# EAGLE design SW6 (EAGLE 5.06)
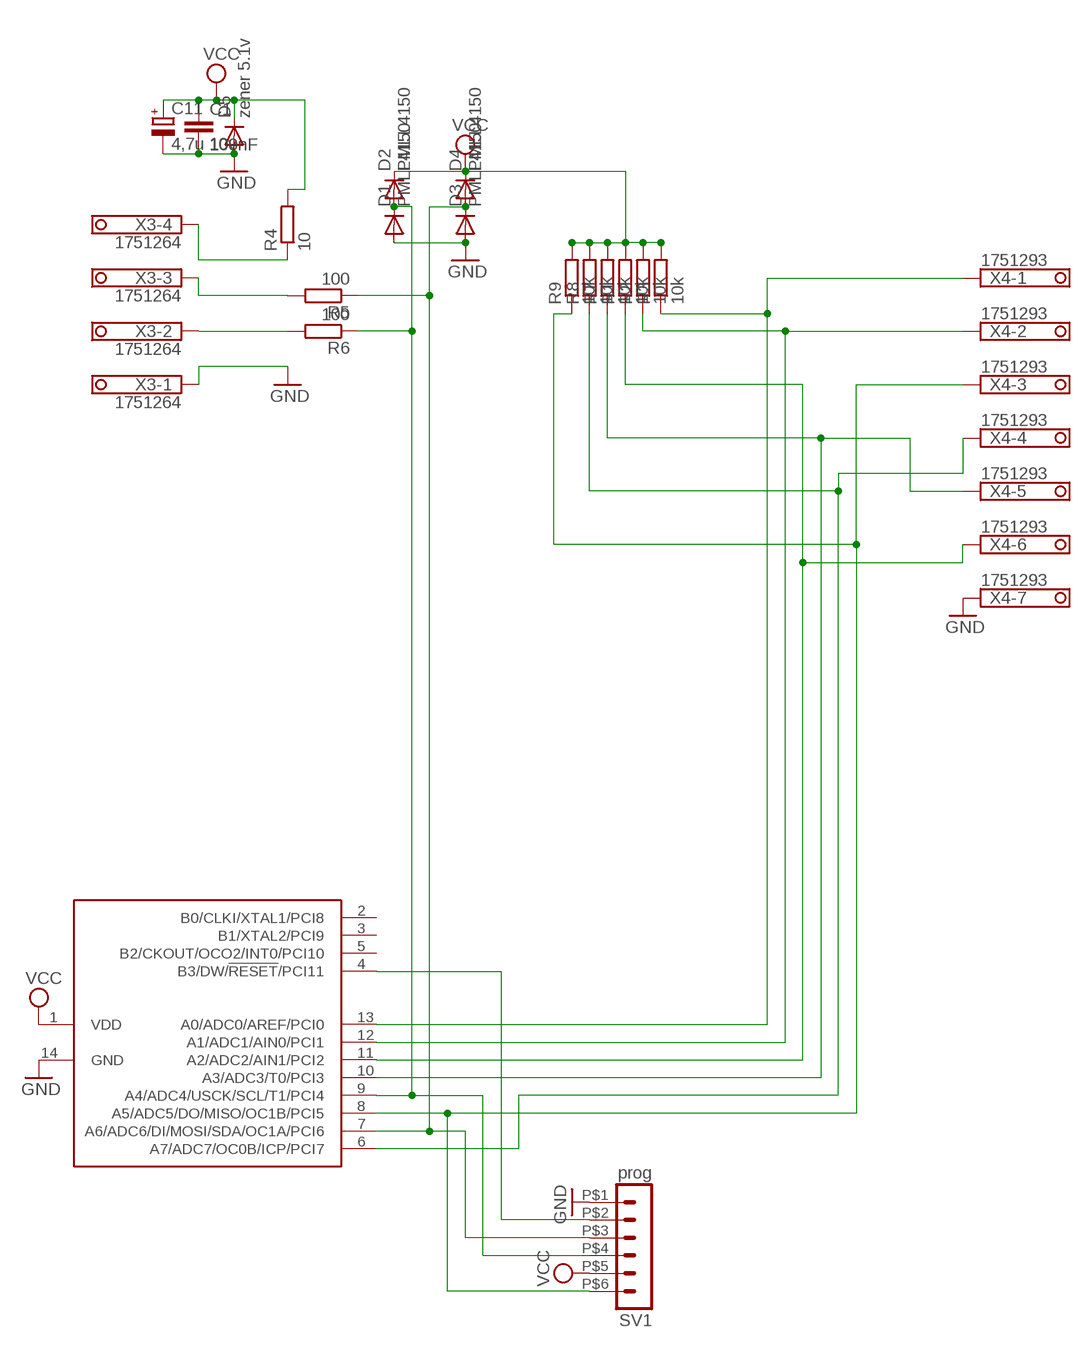
[diagram p0: schematic, sheet 1]

## Parts
C1  100nF  C-EUC0805  [C0805]
C11  4,7u 10v  CPOL-EUB/3528-21R  [B/3528-21R]
D1  PMLL4150  [SOD80C]
D2  PMLL4150  [SOD80C]
D3  PMLL4150  [SOD80C]
D4  PMLL4150  [SOD80C]
D5  zener 5.1v  PMLL4150  [SOD80C]
R1  10k  R-EU_R0805  [R0805]
R2  10k  R-EU_R0805  [R0805]
R3  10k  R-EU_R0805  [R0805]
R4  10  R-EU_R0805  [R0805]
R5  100  R-EU_R0805  [R0805]
R6  100  R-EU_R0805  [R0805]
R7  10k  R-EU_R0805  [R0805]
R8  10k  R-EU_R0805  [R0805]
R9  10k  R-EU_R0805  [R0805]
SV1  prog  MA06-1'  [MA06-1_SMD_MINI]
U$1  TINY24'  [SOIC14]
X3  1751264  [1751264]
X4  1751293  [1751293]

## Nets
CLK: D1.C D2.A R6.1 SV1.P$4 U$1.9(A4/ADC4/USCK/SCL/T1/PCI4)
DATA: D3.C D4.A R5.1 SV1.P$3 U$1.7(A6/ADC6/DI/MOSI/SDA/OC1A/PCI6)
GND: C1.2 C11.- D1.A D3.A D5.A SV1.P$1 U$1.14(GND) X3.1 X4.7
MISO: R9.1 SV1.P$6 U$1.8(A5/ADC5/DO/MISO/OC1B/PCI5) X4.3
N$1: R3.1 U$1.13(A0/ADC0/AREF/PCI0) X4.1
N$2: R2.1 U$1.12(A1/ADC1/AIN0/PCI1) X4.2
N$3: R1.1 U$1.11(A2/ADC2/AIN1/PCI2) X4.6
N$4: R7.1 U$1.10(A3/ADC3/T0/PCI3) X4.5
N$5: SV1.P$2 U$1.4(B3/DW/!RESET!/PCI11)
N$16: R6.2 X3.2
N$17: R5.2 X3.3
N$18: R4.1 X3.4
SCK: R8.1 U$1.6(A7/ADC7/OC0B/ICP/PCI7) X4.4
VCC: C1.1 C11.+ D2.C D4.C D5.C R1.2 R2.2 R3.2 R4.2 R7.2 R8.2 R9.2 SV1.P$5 U$1.1(VDD)
Unconnected: U$1.2(B0/CLKI/XTAL1/PCI8) U$1.3(B1/XTAL2/PCI9) U$1.5(B2/CKOUT/OCO2/INT0/PCI10)

## Library data of the parts
C1 = rcl:C-EU: CAPACITOR, European symbol
C11 = rcl:CPOL-EU: POLARIZED CAPACITOR, European symbol
D1-D5 = diode:PMLL4150: DIODE high speed
R1-R9 = rcl:R-EU_: RESISTOR, European symbol
SV1 = con-lstb:MA06-1: PIN HEADER
U$1 = atmel:TINY24
X3 = con-phoenix-350:1751264: MKDS 1/ 4-3,5 Printklemme Nennstrom: 10 A Bemessungsspannung: 160 V Raster: 3,5 mm Polzahl: 4 Montageart: Löten Anschlussart: Schraubanschluss Anschlussrichtung vom Leiter zur Platine: 0° Source: http://eshop.phoenixcontact.com .. 1751264.pdf
X4 = con-phoenix-350:1751293: MKDS 1/ 7-3,5 Printklemme Nennstrom: 10 A Bemessungsspannung: 160 V Raster: 3,5 mm Polzahl: 7 Montageart: Löten Anschlussart: Schraubanschluss Anschlussrichtung vom Leiter zur Platine: 0° Source: http://eshop.phoenixcontact.com .. 1751293.pdf

## Board
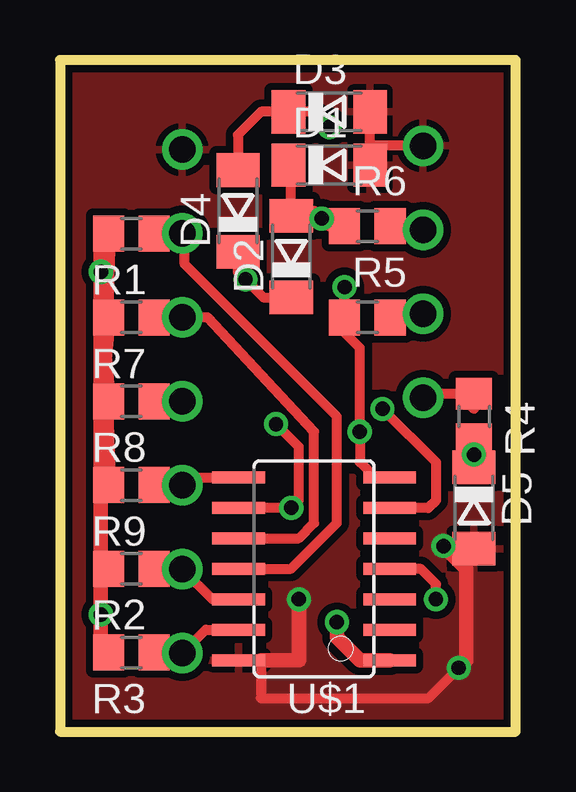
[diagram p1: board, top side]
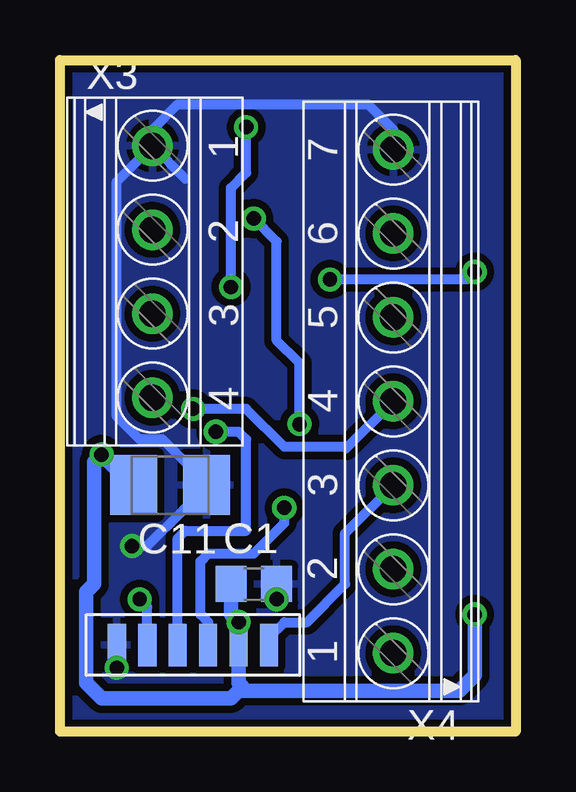
[diagram p2: board, bottom side, seen from below]

Size 19 x 28 mm. Coordinates in mm from the lower left corner, seen from the top.
Outline: 19,0 19,28 0,28 0,0 19,0
Copper layers (1*16): Top 0.035mm / dielectric 1.5mm / Bottom 0.035mm
Design rules "default *": minimum track width 10mil, minimum drill 16mil, track to track 8mil, track to pad 8mil, pad to pad 8mil, via to via 8mil, smd to smd 0mil, copper to edge 10mil, drill to drill 8mil, minimum pad ring 10mil, minimum via ring 8mil, stop-mask expansion 4mil, vias tented up to drill 0mil, thermal gap 10mil

### Footprints (pad centres in the part's own frame; a part is rotated, then mirrored left to right if it is on the bottom)
C0805 = smd 1.3 x 1.5: 1 -0.95,0; 2 0.95,0
B/3528-21R = smd 1.95 x 2.5: + 1.525,0; - -1.525,0
SOD80C = smd 1.4 x 1.8: A 1.7,0; C -1.7,0
R0805 = smd 1.3 x 1.5: 1 -0.95,0; 2 0.95,0
MA06-1_SMD_MINI = smd 0.762 x 1.778: P$1 -3.81,0; P$2 -2.54,0; P$3 -1.27,0; P$4 0,0; P$5 1.27,0; P$6 2.54,0
SOIC14 = smd 0.5 x 2.2: 1 -3.175,-3.154; 2 -1.915,-3.154; 3 -0.645,-3.154; 4 0.625,-3.154; 5 1.895,-3.154; 6 3.165,-3.154; 7 4.435,-3.154; 8 4.445,3.154; 9 3.175,3.154; 10 1.905,3.154; 11 0.635,3.154; 12 -0.635,3.154; 13 -1.905,3.154; 14 -3.175,3.154
1751264 = drill 1.1 pad 1.7 round: 1 -5.25,-0.1; 2 -1.75,-0.1; 3 1.75,-0.1; 4 5.25,-0.1
1751293 = drill 1.1 pad 1.7 round: 1 -10.5,-0.1; 2 -7,-0.1; 3 -3.5,-0.1; 4 0,-0.1; 5 3.5,-0.1; 6 7,-0.1; 7 10.5,-0.1

### Placement (x,y rotation side)
C1  10.91,6.15 0 bottom
C11  14.41,10.28 180 bottom
D1  11.23,23.61 0 top
D2  9.65,19.8 90 top
D3  11.23,25.83 0 top
D4  7.42,21.71 90 top
D5  17.27,9.33 270 top
R1  2.98,20.75 180 top
R2  2.98,6.78 180 top
R3  2.98,3.29 180 top
R4  17.27,13.14 270 top
R5  12.82,17.26 0 top
R6  12.82,21.07 0 top
R7  2.98,17.26 180 top
R8  2.98,13.77 180 top
R9  2.98,10.28 180 top
SV1  12.82,3.61 0 bottom
U$1  10.6,6.15 90 top
X3  15.04,19.17 270 bottom
X4  5.2,13.77 90 bottom

### Tracks (layer width: path | path; a pad name or v marks a point on that pad's centre or on a via)
CLK  (via drill 0.6)
  Top 0.406: D1.C 9.65,23.5 D2.A 9.85,21.71 10.6,21.71 v10.91,21.39 11.23,21.07 R6.1 | U$1.9 v9.65,9.33 9.96,9.64 9.96,11.87 v9.01,12.82
  Bottom 0.406: v10.91,21.39 9.96,20.44 9.96,16.31 9.01,15.36 v9.01,12.82 | SV1.P$4 12.82,4.56 13.14,4.88 13.14,7.1 12.82,7.42 10.91,7.42 9.65,8.69 v9.65,9.33
DATA  (via drill 0.6)
  Top 0.406: v11.23,25.2 10.6,25.83 D3.C 8.38,25.83 7.42,24.88 D4.A | R5.1 v11.87,18.53 11.87,16.63 12.5,15.99 v12.5,12.5 12.5,11.23 13.14,10.59 14.41,10.59 U$1.7
  Bottom 0.406: v11.23,25.2 11.23,23.3 11.87,22.66 v11.87,18.53 | v12.5,12.5 11.55,12.5 11.23,12.18 11.23,8.37 13.77,8.37 14.09,8.05 SV1.P$3
GND  (via drill 0.6)
  Top 0.406: X3.1 12.99,24.42 12.82,24.25 12.82,23.72 D1.A D3.A | U$1.14 8.38,2.98 8.38,1.39 15.36,1.39 v16.63,2.66 | D5.A 16.74,7.62 v15.99,7.74
  Top 0.61: v9.96,5.52 9.96,2.98 8.38,2.98 | v15.99,7.74 16.95,6.78 16.95,2.98 v16.63,2.66
  Bottom 0.406: X4.7 5.1,25.1 6.15,26.15 14.09,26.15 15.14,25.1 X3.1 | X3.1 13.77,23.05 | v15.99,7.74 15.36,7.74 13.83,9.27 12.88,9.27 C11.- 12.88,10.34 14.73,12.18 15.68,12.18 16.63,13.14 16.63,22.93 X3.1
  Bottom 0.61: v16.63,2.66 SV1.P$1 | C1.2 v9.97,5.52 v9.96,5.52
  pour Top (isolate 0.305): 19.17,27.42 0.12,27.42 0.12,0.44 19.17,0.44
  pour Bottom (isolate 0.305): 19.17,27.42 0.12,27.42 0.12,0.44 19.17,0.44
MISO
  Top 0.406: U$1.8 5.42,10.59 X4.3 R9.1
  Bottom 0.406: X4.3 7.1,8.27 7.1,6.15 8.69,4.56 9.65,4.56 10.28,3.93 SV1.P$6
N$1
  Top 0.406: U$1.13 6.08,4.24 X4.1 5.08,3.29 R3.1
N$2
  Top 0.406: U$1.12 6.35,5.52 X4.2
  Top 0.61: R2.1 5.09,6.78 X4.2
N$3
  Top 0.406: U$1.11 9.65,6.78 11.55,8.69 11.55,13.14 5.2,19.48 5.2,20.67 X4.6 5.09,20.75 R1.1
N$4
  Top 0.406: U$1.10 9.96,8.05 10.6,8.69 10.6,12.5 6.15,17.26 X4.5 R7.1
N$5  (via drill 0.6)
  Top 0.406: U$1.4 15.05,6.77 15.68,6.15 v15.68,5.52
  Bottom 0.406: SV1.P$2 15.36,5.2 v15.68,5.52
N$16
  Top 0.406: R6.2 14.67,21.07 X3.2
N$17
  Top 0.406: R5.2 14.67,17.26 X3.3
N$18
  Top 0.406: R4.1 17.27,13.45 16.63,14.09 15.31,14.09 X3.4
SCK  (via drill 0.6)
  Top 0.406: X4.4 R8.1 | U$1.6 15.35,9.31 15.68,9.64 15.68,11.23 v13.45,13.45
  Bottom 0.406: X4.4 7.05,11.81 7.1,11.87 9.65,11.87 11.23,13.45 v13.45,13.45
VCC  (via drill 0.6)
  Top 0.406: D2.C 8.49,18.1 v7.74,18.85 7.42,19.17 D4.C | D5.C v17.27,11.55 R4.2
  Top 0.61: R9.2 1.71,20.75 v1.71,19.17 1.71,17.58 | 1.71,17.58 R8.2 | 1.71,6.78 v1.71,4.88 1.71,3.61 R3.2 | 1.71,6.78 1.71,10.59 | 1.71,10.59 1.71,13.77 | 1.71,13.77 1.71,17.58 | 1.71,6.78 R2.2 | 1.71,10.59 R1.2 | 1.71,13.77 R7.2 | v11.55,4.56 11.55,3.93 12.5,2.98 U$1.1
  Bottom 0.406: v7.74,18.85 2.02,18.85 v1.71,19.17 | 15.68,9.7 C11.+ 15.93,10.22
  Bottom 0.61: v1.71,4.88 1.71,2.34 2.34,1.7 11.55,1.7 | 15.93,10.22 v17.27,11.55 17.58,11.23 17.58,6.15 17.9,5.83 17.9,2.02 17.27,1.39 11.87,1.39 11.55,1.7 | 11.39,1.86 11.55,2.02 SV1.P$5 v11.55,4.56 11.87,4.88 C1.1 | 11.55,1.7 11.39,1.86 | 11.55,1.7 | 11.39,1.86 11.55,1.7